# Altium schematic sheet thermokoppel.SchDoc: soldeerstation
size A4; Date: 24/02/2023; Author: Samy Warnants; CompanyName: pxl; DrawnBy: Samy warnants; Engineer: Samy Warnants; Organization: elektronica; DocumentNumber: 1; Revision: v1.0; SheetNumber: 2; SheetTotal: 4; Time: 9:51
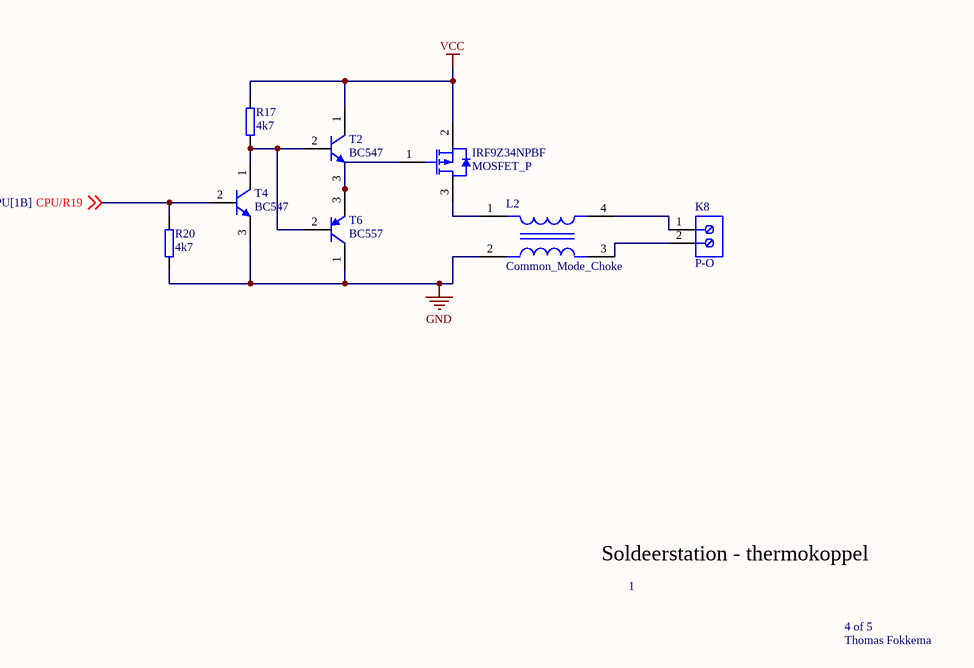
[diagram p0: thermokoppel.SchDoc]

## Parts
IRF9Z34NPBF  MOSFET_P  [TO_252]
K8  P-O  [PHOE-1714955_V]
L2  Common_Mode_Choke  [2545]
R17  4k7  [R_0805_M]
R20  4k7  [R_0805_M]
T2  BC547  [SOT_23]
T4  BC547  [SOT_23]
T6  BC557  [SOT_23]

## Nets
GND: L2.2 R20.1 T4.3(E) T6.1(C)
VCC: IRF9Z34NPBF.2(SOURCE) R17.2 T2.1(C)
CPU/R19: R20.2 T4.2(B) ; off-sheet CPU/R19
NetIRF9Z34NPBF_1: IRF9Z34NPBF.1(GATE) T2.3(E) T6.3(E)
NetIRF9Z34NPBF_3: IRF9Z34NPBF.3(DRAIN) L2.1
NetK8_1: K8.1 L2.4
NetK8_2: K8.2 L2.3
NetR17_1: R17.1 T2.2(B) T4.1(C) T6.2(B)

## Notes on the sheet
- Soldeerstation - thermokoppel
- 1
- 4 of 5
- Thomas Fokkema

## Library data of the parts
IRF9Z34NPBF = MOSFET_P: Manufacturer: Fairchild Semiconductor; Reel Quantity: 3000; Drain Source Voltage Vds: 20V; Power Dissipation Pd: 500mW; On Resistance Rds(on): 52mohm; Full Power Rating Temperature: 25°C; Voltage Vgs Max: -800mV; Pulse Current Idm: 10A; Rds(on) Test Voltage Vgs: -4.5V; External Depth: 2.5mm; Transistor Case Style: SOT-23; No. of Pins: 3; Continuous Drain Current Id: 2.4A; Voltage Vds Typ: -20V; Voltage Vgs th Max: -1.5V; Transistor Polarity: PChannel; Package Version: Rev. 3, 05/2015; External Width: 3.05mm; External Length / Height: 1.12mm; SMD Marking: 304P; SVHC: NoSVHC(19-Dec-2012); Termination Type: SMD; Datasheet URL: https://www.fairchildsemi.com/datasheets/FD/FDN304P.pdf; Tape Width: 8mm; Mounting Technology: SurfaceMount; Voltage Vgs Rds on Measurement: -4.5V; Operating Temperature Range: -55°Cto+150°C; Current Temperature: 25°C; Operating Temperature Min: -55°C; Threshold Voltage Vgs Typ: -800mV; Package / Case: SOT-23; Manufacturer URL: https://www.fairchildsemi.com/; Voltage Vds: 20V; Datasheet Version: Rev. C, 01/2001; Operating Temperature Max: 150°C; Package Description: 3-Pin Small Outline Transistor, Body 2.92 x 1.4 mm, Pitch 0.95 mm; Current Id Max: 2.4A; Package URL: https://www.fairchildsemi.com/package-drawings/MA/MA03B.pdf; Package Reference: SSOT3L
K8 = CMP-2000-05797-1: PC Terminal Block, Pitch 6.35 mm, 1 x 2 Position, Height 21.5 mm, Tail Lenght 5.1 mm, RoHS, Bulk; Manufacturer: Phoenix Contact; Package Description: PC Terminal Block, Pitch 6.35 mm, 1 x 2 Position, Height 21.5 mm, Tail Lenght 5.1 mm; Datasheet URL: http://media.digikey.com/pdf/Data%20Sheets/Phoenix%20Contact%20PDFs/1714955.pdf; Package Reference: 1714955; Manufacturer URL: http://www.phoenixcontact.com/; Datasheet Version: 02/2010; Mounting Technology: ThroughHole
L2 = Common_Mode_Choke: Max Current Rating: 2A; Number of Lines: 2; Impedance: 900R; Element Configuration: Dual; Insulation Resistance: 10MR; Test Frequency: 100MHz; DC Resistance (DCR): 60mR; Voltage Rating (DC): 50V; Current Rating: 2.3A; Number of Pins: 4; DC Current: 2A; Mount: Surface Mount; Current: 2A; REACH SVHC: No SVHC; Width: 4.5mm; Case/Package: 1808; Voltage Rating: 50V; Package Quantity: 1; Height: 2mm; Max DC Current: 2A; Packaging: Tape and Reel; Max Operating Temperature: 85°C; Lead Free: Lead Free; Length: 0.185inch; Series: ACM; Radiation Hardening: No; Max Voltage Rating (DC): 50V; Termination: Flat; Depth: 4.7mm; RoHS Compliant: Yes; DC Resistance-Max: 60mR; Min Operating Temperature: -40°C
R17 R20 = Resistor: Manufacturer: Vishay Dale; Part Number: CRCW08050000Z0EA
T2 T4 = Transistor_NPN: Manufacturer: On Semiconductor; PartNumber: BC547C; IC Continuous (A): 0.1; fT Min (MHz): 150; Packing: Bulk Box; Polarity: NPN; Mounting Technology: Through Hole; ComponentLink1URL: http://www.onsemi.com/; ComponentLink1Description: Manufacturer URL; ComponentLink3URL: http://www.onsemi.cn/pub_link/Collateral/2N6426-D.PDF; DatasheetVersion: Rev. 7; PackageVersion: Rev. AM; RoHS: FALSE; ComponentLink2URL: http://www.onsemi.com/pub_link/Collateral/BC546-D.PDF; ComponentLink3Description: Package Specification; PackageDescription: 3-Pin Transistor Outline, Body 4.825 x 3.685 mm, Pitch 1.27 mm; PackageReference: TO-92-3-29-11_AM_SL; ComponentLink2Description: Datasheet
T6 = Transistor_PNP: Manufacturer: On Semiconductor; PartNumber: BC557C; Polarity: PNP; IC Continuous (A): -0.1; Packing: Bulk Box; PackageVersion: Rev. AM; RoHS: FALSE; PackageDescription: 3-Pin Transistor Outline, Body 4.825 x 3.685 mm, Pitch 1.27 mm; ComponentLink2Description: Datasheet; DatasheetVersion: Rev. 3; ComponentLink3Description: Package Specification; Mounting Technology: Through Hole; ComponentLink2URL: http://www.onsemi.com/pub_link/Collateral/BC556B-D.PDF; ComponentLink1URL: http://www.onsemi.com/; ComponentLink1Description: Manufacturer URL; ComponentLink3URL: http://www.onsemi.cn/pub_link/Collateral/2N6426-D.PDF; PackageReference: TO-92-3-29-11_AM_SL